# EAGLE schematic memory (EAGLE 6.6.0), part 2 of 2
## Sheet 11 of 15
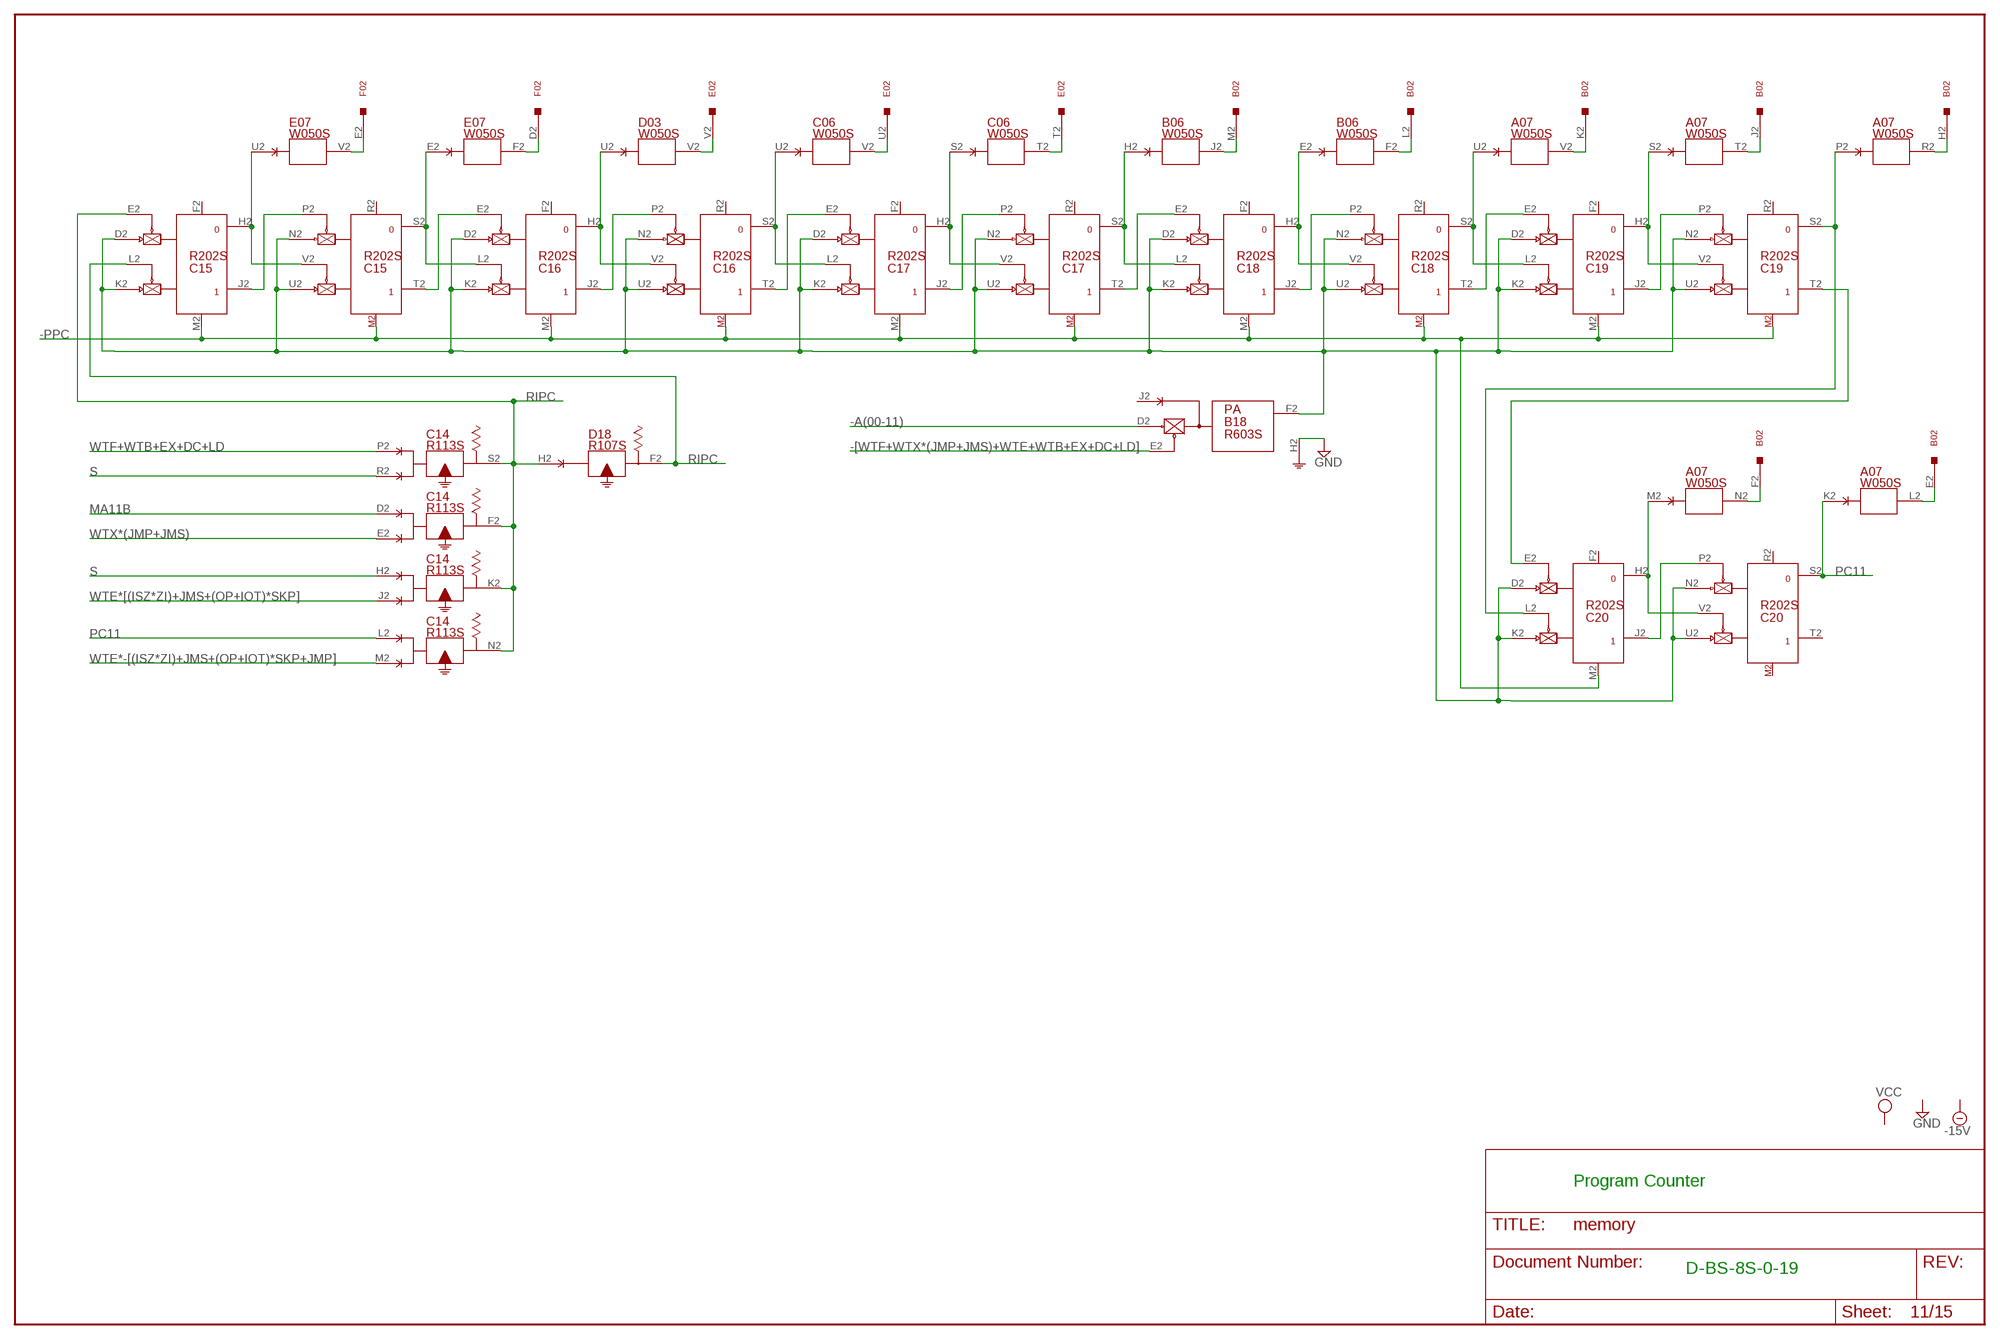
[diagram p10: schematic, sheet 11]

### Parts
C15  R202S  [H807S]
C16  R202S  [H807S]
C17  R202S  [H807S]
C18  R202S  [H807S]
C19  R202S  [H807S]
C20  R202S  [H807S]
D03  W050S  [H807S]

### Nets
-[WTF+WTX*(JMP+JMS)+WTE+WTB+EX+DC+LD]: B18.E2(F:EN0) ; also sheet 6
-A(00-11): B18.D2(F:PU0) ; also sheet 1,3,4,5,7,9,12
-PPC: C15.M2(J:SET) C16.M2(J:SET) C17.M2(J:SET) C18.M2(J:SET) C19.M2(J:SET) C20.M2(J:SET) ; also sheet 4,6,8,10,15
-RIPC: C14.F2(F:O$1) C14.K2(K:O$1) C14.N2(N:O$1) C14.S2(S:O$1) C15.E2(J:EN0) D18.H2(F:I$1)
GND [Supply]: B18.H2(F:G) ; also sheet 1,2,3,4,5,6,7,8,9,10,12,14,15
MA11B: C14.D2(F:I$1) ; also sheet 5
N$245: C15.H2 C15.V2(T:EN1) E07.U2(V:I$1)
N$246: C15.J2 C15.P2(T:EN0)
N$247: B18.F2(F:O) C15.D2(J:PU0) C15.K2(J:PU1) C15.N2(T:PU0) C15.U2(T:PU1) C16.D2(J:PU0) C16.K2(J:PU1) C16.N2(T:PU0) C16.U2(T:PU1) C17.D2(J:PU0) C17.K2(J:PU1) C17.N2(T:PU0) C17.U2(T:PU1) C18.D2(J:PU0) C18.K2(J:PU1) C18.N2(T:PU0) C18.U2(T:PU1) C19.D2(J:PU0) C19.K2(J:PU1) C19.N2(T:PU0) C19.U2(T:PU1) C20.D2(J:PU0) C20.K2(J:PU1) C20.N2(T:PU0) C20.U2(T:PU1)
N$248: C16.H2 C16.V2(T:EN1) D03.U2(V:I$1)
N$249: C16.J2 C16.P2(T:EN0)
N$250: A07.L2(L:O$1) B02.E2
N$251: C06.S2(T:I$1) C17.H2 C17.V2(T:EN1)
N$252: C17.J2 C17.P2(T:EN0)
N$253: A07.N2(N:O$1) B02.F2
N$254: B06.E2(F:I$1) C18.H2 C18.V2(T:EN1)
N$255: C18.J2 C18.P2(T:EN0)
N$256: A07.V2(V:O$1) B02.K2
N$257: A07.S2(T:I$1) C19.H2 C19.V2(T:EN1)
N$258: C19.J2 C19.P2(T:EN0)
N$259: A07.T2(T:O$1) B02.J2
N$260: A07.M2(N:I$1) C20.H2 C20.V2(T:EN1)
N$261: C20.J2 C20.P2(T:EN0)
N$262: A07.R2(R:O$1) B02.H2
N$263: C15.S2 C16.L2(J:EN1) E07.E2(F:I$1)
N$264: C15.T2 C16.E2(J:EN0)
N$265: C06.U2(V:I$1) C16.S2 C17.L2(J:EN1)
N$266: C16.T2 C17.E2(J:EN0)
N$267: B06.H2(J:I$1) C17.S2 C18.L2(J:EN1)
N$268: A07.U2(V:I$1) C18.S2 C19.L2(J:EN1)
N$269: C18.T2 C19.E2(J:EN0)
N$270: C17.T2 C18.E2(J:EN0)
N$271: A07.P2(R:I$1) C19.S2 C20.L2(J:EN1)
N$272: C19.T2 C20.E2(J:EN0)
N$273: B02.M2 B06.J2(J:O$1)
N$274: B02.L2 B06.F2(F:O$1)
N$275: D03.V2(V:O$1) E02.V2
N$276: C06.V2(V:O$1) E02.U2
N$277: C06.T2(T:O$1) E02.T2
N$278: E07.V2(V:O$1) F02.E2
N$279: E07.F2(F:O$1) F02.D2
PC11: A07.K2(L:I$1) C14.L2(N:I$1) C20.S2 ; also sheet 1,5,7
RIPC: C15.L2(J:EN1) D18.F2(F:O$1)
S: C14.H2(K:I$1) C14.R2(S:I$2) ; also sheet 1,5,7,12
WTE*-[(ISZ*ZI)+JMS+(OP+IOT)*SKP+JMP]: C14.M2(N:I$2) ; also sheet 5,6
WTE*[(ISZ*ZI)+JMS+(OP+IOT)*SKP]: C14.J2(K:I$2) ; also sheet 5,6
WTF+WTB+EX+DC+LD: C14.P2(S:I$1) ; also sheet 6
WTX*(JMP+JMS): C14.E2(F:I$2) ; also sheet 5,6,15
Unconnected: B18.J2(F:I$1) C15.F2(J:RESET) C15.R2(T:RESET) C16.F2(J:RESET) C16.R2(T:RESET) C17.F2(J:RESET) C17.R2(T:RESET) C18.F2(J:RESET) C18.R2(T:RESET) C19.F2(J:RESET) C19.R2(T:RESET) C20.F2(J:RESET) C20.R2(T:RESET) C20.T2

### Notes on the sheet
- Program Counter
- D-BS-8S-0-19

## Sheet 12 of 15
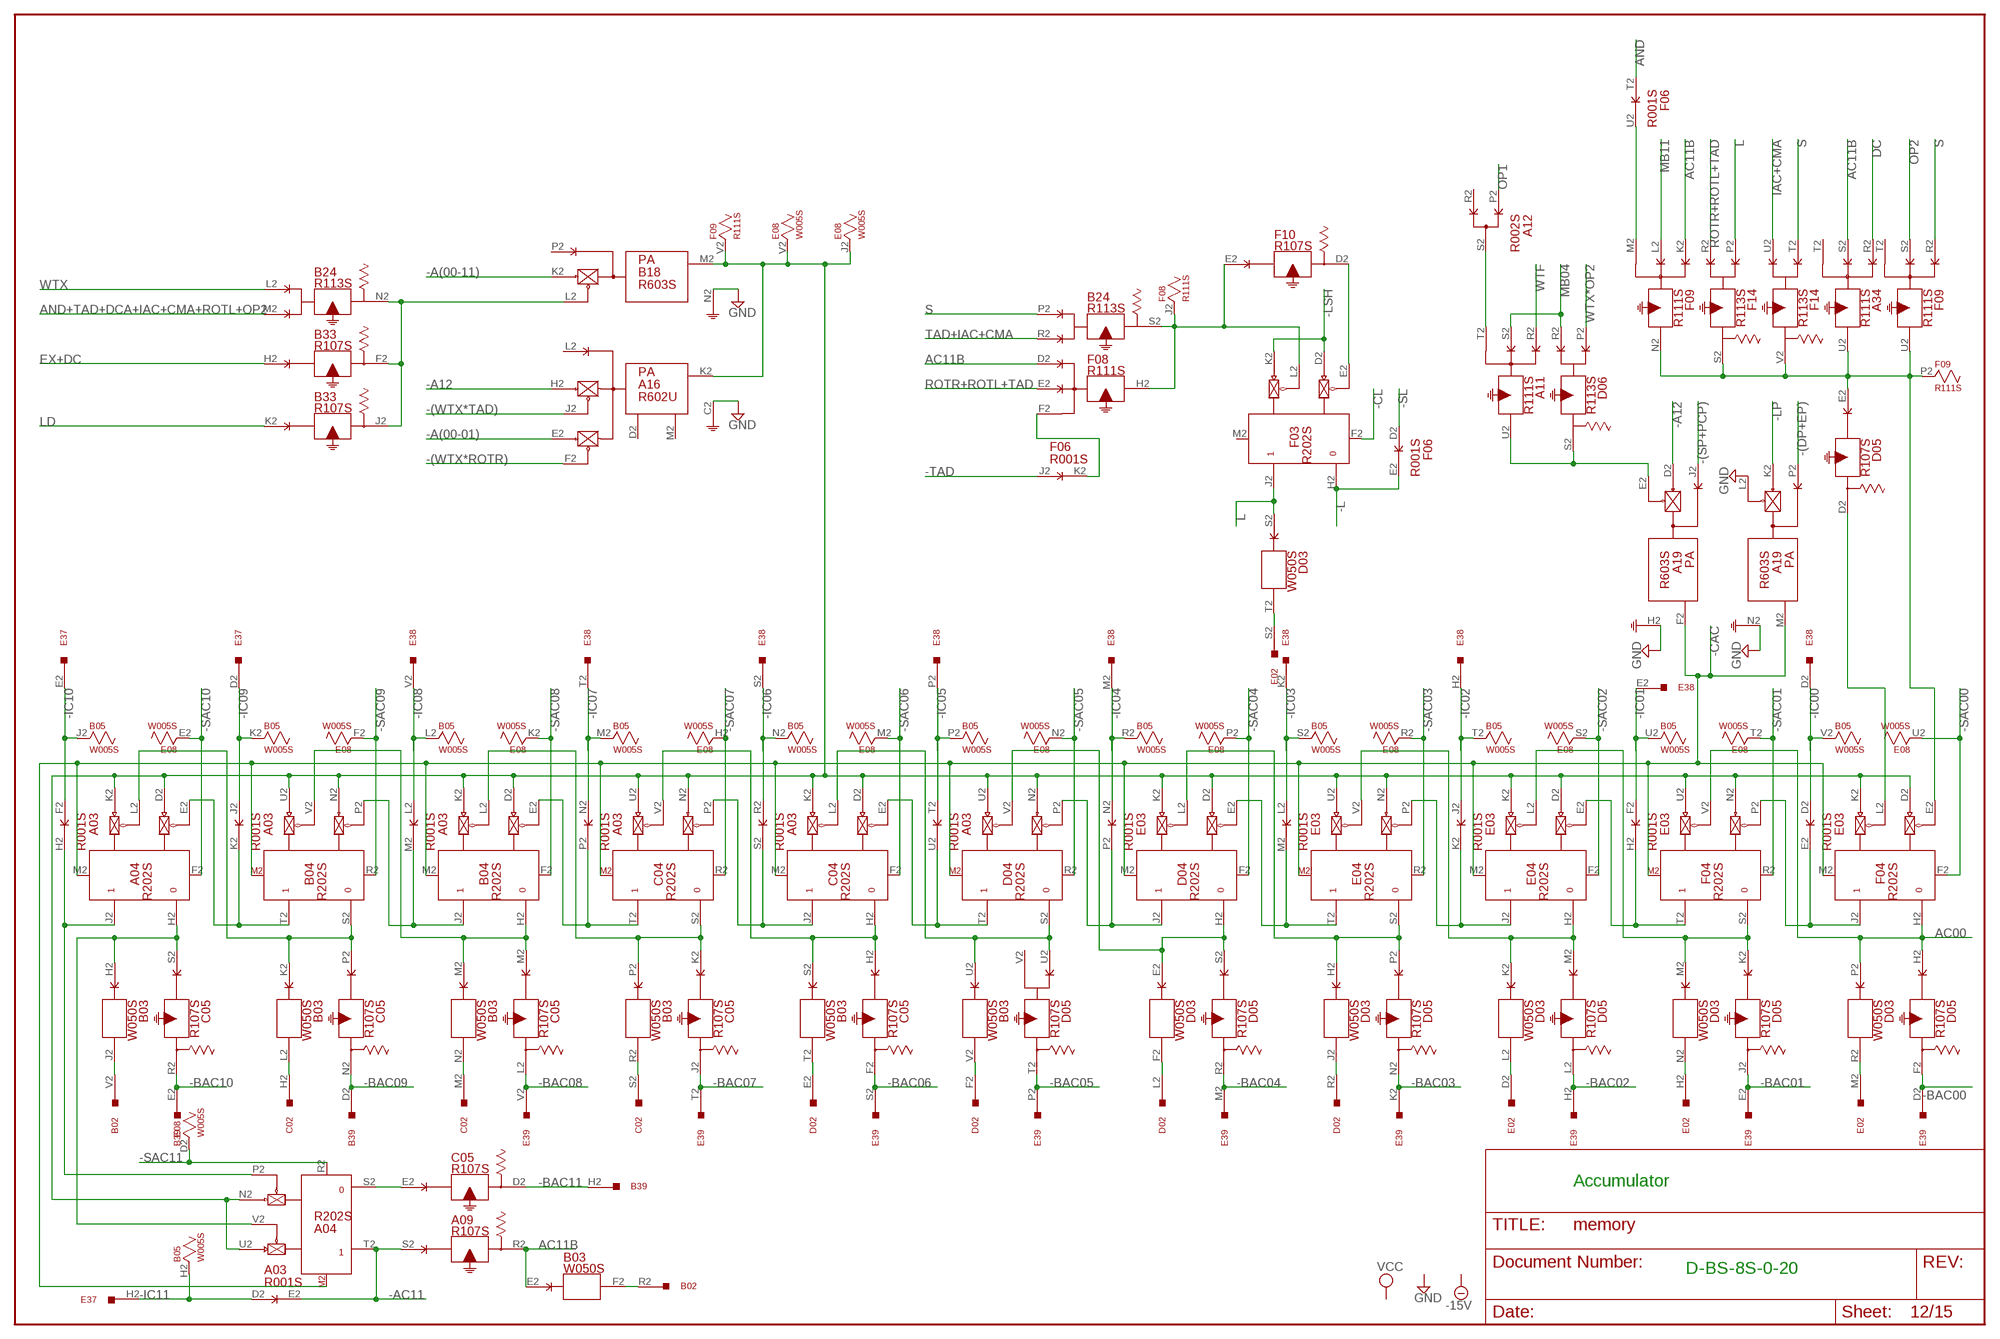
[diagram p11: schematic, sheet 12]

### Parts
A03  R001S  [H807S]
A04  R202S  [H807S]
A19  R603S  [H807S]
B03  W050S  [H807S]
B04  R202S  [H807S]
C04  R202S  [H807S]
D04  R202S  [H807S]
D05  R107S  [H807S]
E04  R202S  [H807S]
E08  W005S  [H807S]
E38  W028S  [H807S]
E39  W028S  [H807S]
F04  R202S  [H807S]

### Nets
-(DP+EP): A19.P2(M:I$1) ; also sheet 4,6,8
-(SP+PCP): A19.J2(F:I$1) ; also sheet 1,3,7,8,10,14,15
-(WTX*ROTR): A16.F2(K:F) ; also sheet 3,6
-(WTX*TAD): A16.J2(K:J) ; also sheet 6
-A12: A16.H2(K:H) A19.D2(F:PU0) ; also sheet 1,3,4,6,8,10,15
-A(00-01): A16.E2(K:E) ; also sheet 3,4
-A(00-11): B18.K2(M:PU0) ; also sheet 1,3,4,5,7,9,11
-AC11: A03.E2(E:E) A04.T2 A09.S2(R:I$1) ; also sheet 7
-BAC00: D05.F2(F:O$1) E39.D2
-BAC01: D05.J2(J:O$1) E39.E2
-BAC02: D05.L2(L:O$1) E39.H2
-BAC03: D05.N2(N:O$1) E39.K2
-BAC04: D05.R2(R:O$1) E39.M2
-BAC05: D05.T2(T:O$1) E39.P2
-BAC06: C05.F2(F:O$1) E39.S2
-BAC07: C05.J2(J:O$1) E39.T2
-BAC08: C05.L2(L:O$1) E39.V2
-BAC09: B39.D2 C05.N2(N:O$1)
-BAC10: B39.E2 C05.R2(R:O$1)
-BAC11: B39.H2 C05.D2(D:O$1)
-CAC: A04.M2(J:SET) A19.F2(F:O) A19.M2(M:O) B04.M2(J:SET) C04.M2(J:SET) D04.M2(J:SET) E04.M2(J:SET) F04.M2(J:SET) ; also sheet 10
-CL: F03.F2(J:RESET) ; also sheet 3
-IC00: B05.V2 E03.D2(E:D) E38.D2
-IC01: B05.U2 E03.F2(H:D) E38.E2
-IC02: B05.T2 E03.J2(K:D) E38.H2
-IC03: B05.S2 E03.L2(M:D) E38.K2
-IC04: B05.R2 E03.N2(P:D) E38.M2
-IC05: A03.T2(U:D) B05.P2 E38.P2
-IC06: A03.R2(S:D) B05.N2 E38.S2
-IC07: A03.N2(P:D) B05.M2 E38.T2
-IC08: A03.L2(M:D) B05.L2 E38.V2
-IC09: A03.J2(K:D) B05.K2 E37.D2
-IC10: A03.F2(H:D) B05.J2 E37.E2
-IC11: A03.D2(E:D) B05.H2 E37.H2
-L: F03.H2 F06.E2(E:E) ; also sheet 3
-LP: A19.K2(M:PU0) ; also sheet 4,6,8,15
-LSH: F03.D2(J:PU0) F03.K2(J:PU1) ; also sheet 3
-SAC00: E08.U2 F04.F2(J:RESET) ; also sheet 8
-SAC01: E08.T2 F04.R2(T:RESET) ; also sheet 8
-SAC02: E04.F2(J:RESET) E08.S2 ; also sheet 8
-SAC03: E04.R2(T:RESET) E08.R2 ; also sheet 8
-SAC04: D04.F2(J:RESET) E08.P2 ; also sheet 8
-SAC05: D04.R2(T:RESET) E08.N2 ; also sheet 8
-SAC06: C04.F2(J:RESET) E08.M2 ; also sheet 8
-SAC07: C04.R2(T:RESET) E08.H2 ; also sheet 8
-SAC08: B04.F2(J:RESET) E08.K2 ; also sheet 8
-SAC09: B04.R2(T:RESET) E08.F2 ; also sheet 8
-SAC10: A04.F2(J:RESET) E08.E2 ; also sheet 8
-SAC11: A04.R2(T:RESET) E08.D2 ; also sheet 8
-SL: F06.D2(E:D) ; also sheet 3
-TAD: F06.J2(K:D) ; also sheet 9
AC00: D03.P2(R:I$1) D05.H2(F:I$1) F04.H2 F04.V2(T:EN1) ; also sheet 3
AC11B: A09.R2(R:O$1) A34.S2(U:I$2) B03.E2(F:I$1) F08.D2(H:I$1) F09.K2(N:I$1) ; also sheet 1,7
AND: F06.T2(U:D) ; also sheet 9
AND+TAD+DCA+IAC+CMA+ROTL+OP2: B24.M2(N:I$2) ; also sheet 9
DC: A34.R2(U:I$1) ; also sheet 1,8
EX+DC: B33.H2(F:I$1) ; also sheet 5,7,8,9
GND [Supply]: A16.C2(K:GND) A19.H2(F:G) A19.L2(M:EN0) A19.N2(M:G) B18.N2(M:G) ; also sheet 1,2,3,4,5,6,7,8,9,10,11,14,15
IAC+CMA: F14.U2(V:I$2) ; also sheet 7,9
L: D03.S2(T:I$1) F03.J2 F14.P2(S:I$1) ; also sheet 3,7
LD: B33.K2(J:I$1) ; also sheet 7,8
MB04: A11.S2(U:I$2) D06.R2(S:I$2) ; also sheet 1
MB11: F09.L2(N:I$2) ; also sheet 1,5,6,7,9
N$281: D03.M2(N:I$1) D05.K2(J:I$1) E04.L2(J:EN1) F04.S2
N$282: B03.U2(V:I$1) C04.L2(J:EN1) D04.S2 D05.U2(T:I$1)
N$283: B02.R2 B03.F2(F:O$1)
N$284: D03.K2(L:I$1) D05.M2(L:I$1) E04.H2 E04.V2(T:EN1)
N$285: D03.E2(F:I$1) D04.H2 D04.V2(T:EN1) D05.S2(R:I$1)
N$286: D03.H2(J:I$1) D04.L2(J:EN1) D05.P2(N:I$1) E04.S2
N$287: B03.S2(T:I$1) C04.H2 C04.V2(T:EN1) C05.H2(F:I$1)
N$288: B03.P2(R:I$1) B04.L2(J:EN1) C04.S2 C05.K2(J:I$1)
N$289: A04.L2(J:EN1) B03.K2(L:I$1) B04.S2 C05.P2(N:I$1)
N$290: A04.H2 A04.V2(T:EN1) B03.H2(J:I$1) C05.S2(R:I$1)
N$291: B02.V2 B03.J2(J:O$1)
N$293: A04.S2 C05.E2(D:I$1)
N$294: B03.L2(L:O$1) C02.H2
N$295: B03.N2(N:O$1) C02.M2
N$296: B03.R2(R:O$1) C02.S2
N$297: B03.T2(T:O$1) D02.E2
N$298: B03.V2(V:O$1) D02.F2
N$299: D02.L2 D03.F2(F:O$1)
N$300: D02.R2 D03.J2(J:O$1)
N$301: D03.L2(L:O$1) E02.D2
N$302: D03.N2(N:O$1) E02.H2
N$303: D03.R2(R:O$1) E02.M2
N$304: E03.E2(E:E) F04.J2 F04.P2(T:EN0)
N$305: E03.H2(H:E) E04.E2(J:EN0) F04.T2
N$306: E03.K2(K:E) E04.J2 E04.P2(T:EN0)
N$307: D04.E2(J:EN0) E03.M2(M:E) E04.T2
N$308: A03.U2(U:E) C04.E2(J:EN0) D04.T2
N$309: D04.J2 D04.P2(T:EN0) E03.P2(P:E)
N$310: A03.S2(S:E) C04.J2 C04.P2(T:EN0)
N$311: A03.P2(P:E) B04.E2(J:EN0) C04.T2
N$312: A03.M2(M:E) B04.J2 B04.P2(T:EN0)
N$313: A03.K2(K:E) A04.E2(J:EN0) B04.T2
N$314: A03.H2(H:E) A04.J2 A04.P2(T:EN0)
N$315: A04.D2(J:PU0) A04.K2(J:PU1) A04.N2(T:PU0) A04.U2(T:PU1) A16.K2(K:K) B04.D2(J:PU0) B04.K2(J:PU1) B04.N2(T:PU0) B04.U2(T:PU1) B18.M2(M:O) C04.D2(J:PU0) C04.K2(J:PU1) C04.N2(T:PU0) C04.U2(T:PU1) D04.D2(J:PU0) D04.K2(J:PU1) D04.N2(T:PU0) D04.U2(T:PU1) E04.D2(J:PU0) E04.K2(J:PU1) E04.N2(T:PU0) E04.U2(T:PU1) E08.J2 E08.V2 F04.D2(J:PU0) F04.K2(J:PU1) F04.N2(T:PU0) F04.U2(T:PU1) F09.V2
N$317: B03.M2(N:I$1) B04.H2 B04.V2(T:EN1) C05.M2(L:I$1)
N$318: A34.U2(U:O$1) D05.E2(D:I$1) F04.E2(J:EN0) F09.N2(N:O$1) F09.P2 F09.U2(U:O$1) F14.S2(S:O$1) F14.V2(V:O$1)
N$319: D05.D2(D:O$1) F04.L2(J:EN1)
N$320: F06.U2(U:E) F09.M2(N:I$3)
N$321: A11.T2(U:I$3) A12.S2(S:F)
N$322: A11.U2(U:O$1) A19.E2(F:EN0) D06.S2(S:O$1)
N$323: D03.T2(T:O$1) E02.S2
N$326: F03.E2(J:EN0) F10.D2(D:O$1)
N$327: B24.S2(S:O$1) F03.L2(J:EN1) F08.H2(H:O$1) F08.J2 F10.E2(D:I$1)
N$328: F06.K2(K:E) F08.F2(H:I$3)
N$330: B18.L2(M:EN0) B24.N2(N:O$1) B33.F2(F:O$1) B33.J2(J:O$1)
OP1: A12.P2(S:D) ; also sheet 6,7,9
OP2: F09.S2(U:I$2) ; also sheet 3,6,7,8,9
ROTR+ROTL+TAD: F08.E2(H:I$2) F14.R2(S:I$2) ; also sheet 3,9
S: B24.P2(S:I$1) F09.R2(U:I$1) F14.T2(V:I$1) ; also sheet 1,5,7,11
TAD+IAC+CMA: B24.R2(S:I$2) ; also sheet 3,9
WTF: A11.R2(U:I$1) ; also sheet 1,3,5,6,8,10
WTX: B24.L2(N:I$1) ; also sheet 1,3,6,7,10,15
WTX*OP2: D06.P2(S:I$1) ; also sheet 6
Unconnected: A12.R2(S:E) A16.D2(K:D) A16.L2(K:L) A16.M2(K:M) A34.T2(U:I$3) B18.P2(M:I$1) D05.V2(T:I$2) E08.L2 F03.M2(J:SET) F09.T2(U:I$3)

### Notes on the sheet
- Accumulator
- D-BS-8S-0-20

## Sheet 13 of 15
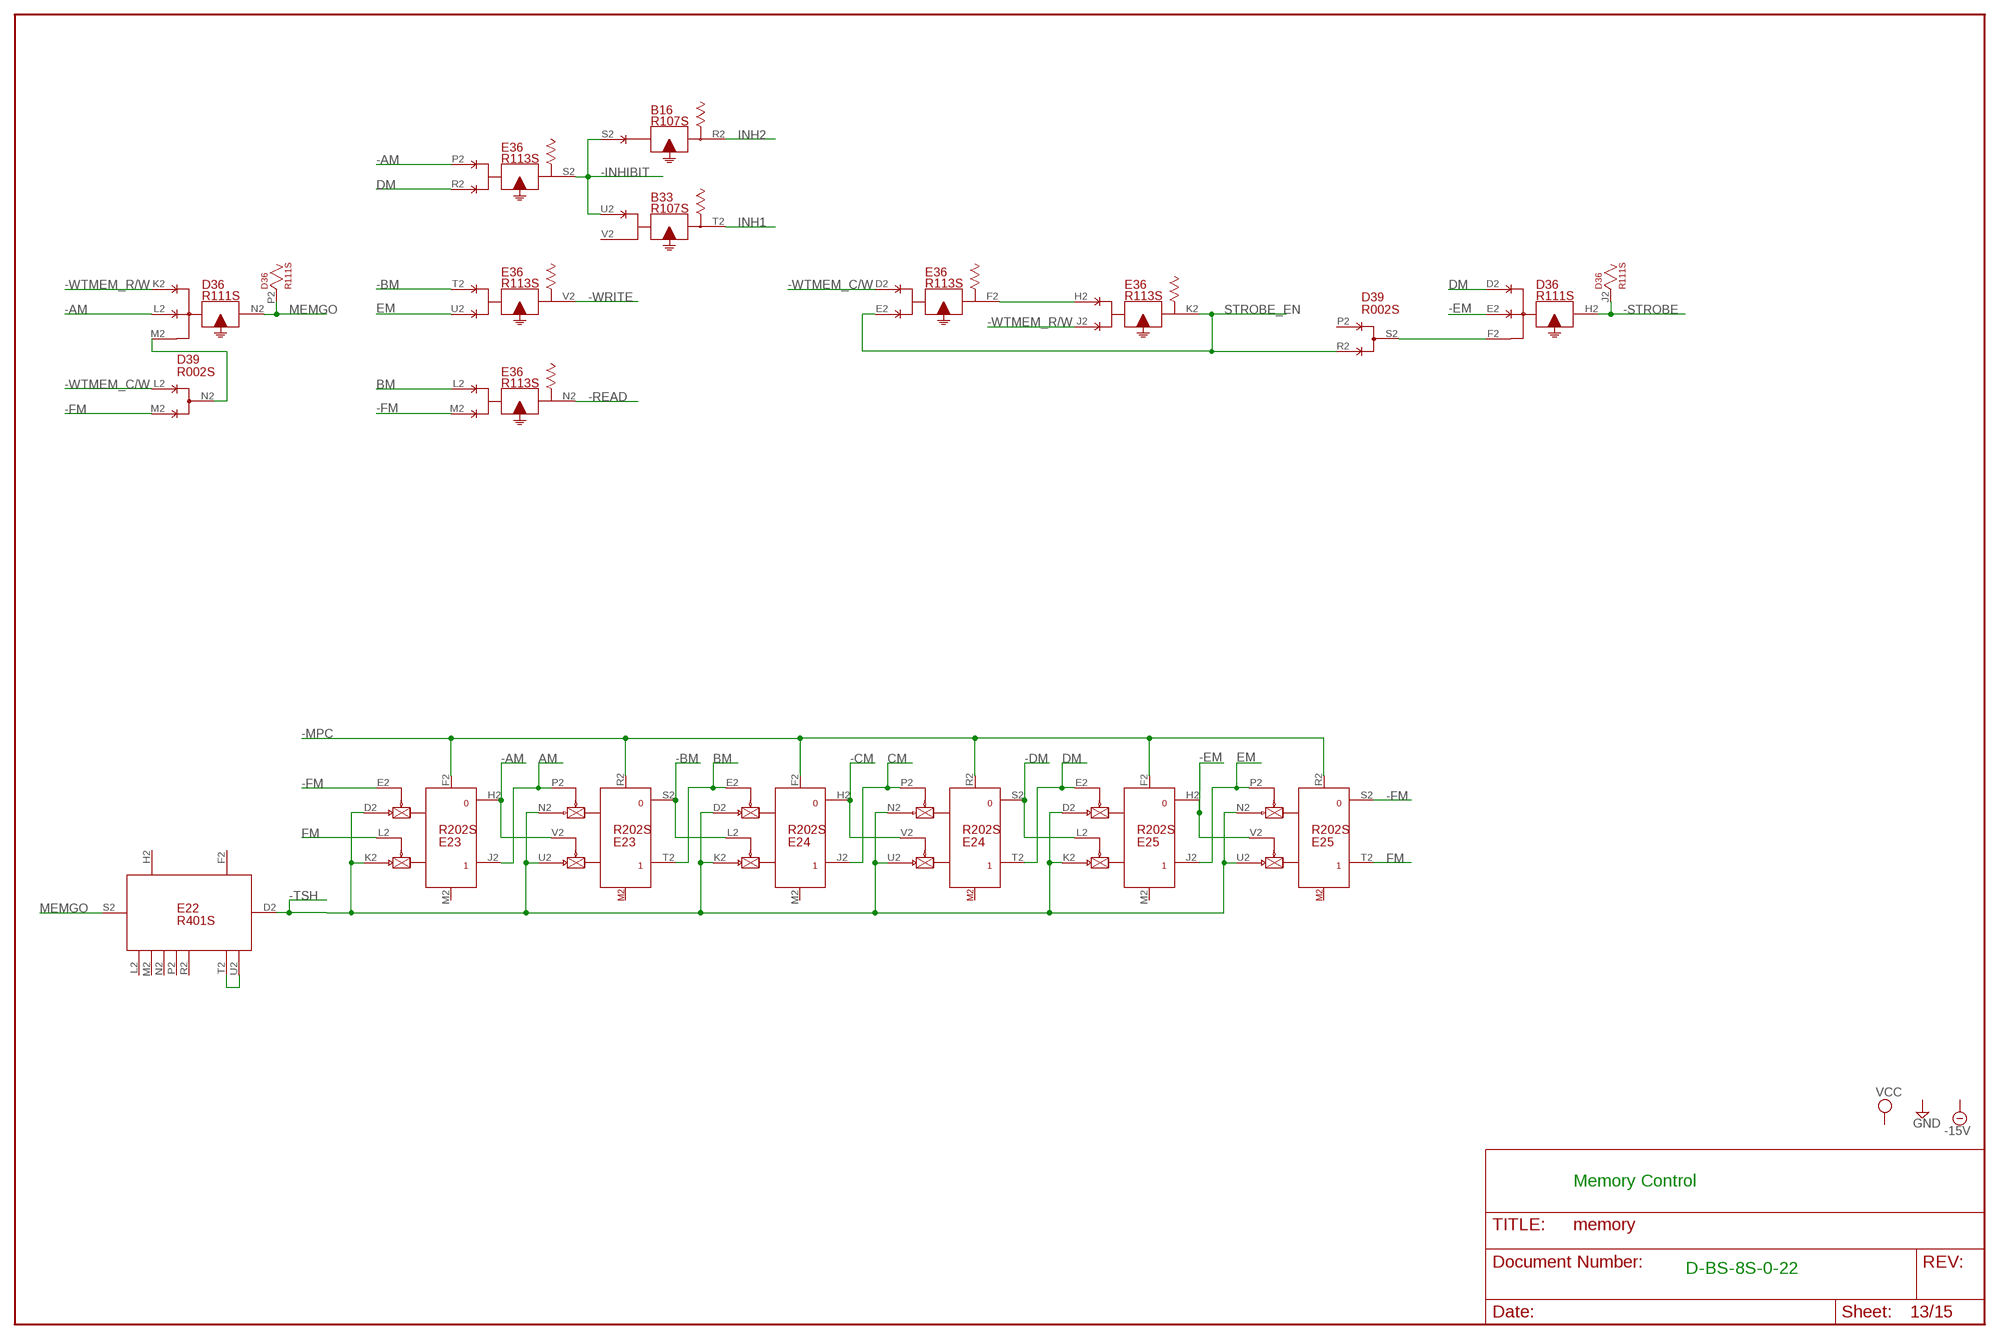
[diagram p12: schematic, sheet 13]

### Parts
E22  R401S  [H807S]
E23  R202S  [H807S]
E24  R202S  [H807S]
E25  R202S  [H807S]
E36  R113S  [H807S]

### Nets
-AM: D36.L2(N:I$2) E23.H2 E23.V2(T:EN1) E36.P2(S:I$1)
-BM: E23.S2 E24.L2(J:EN1) E36.T2(V:I$1)
-CM: E24.H2 E24.V2(T:EN1)
-DM: E24.S2 E25.L2(J:EN1)
-EM: D36.E2(H:I$2) E25.H2 E25.V2(T:EN1)
-FM: D39.M2(N:E) E23.E2(J:EN0) E25.S2 E36.M2(N:I$2)
-INHIBIT: B16.S2(R:I$1) B33.U2(T:I$1) E36.S2(S:O$1)
-MPC: E23.F2(J:RESET) E23.R2(T:RESET) E24.F2(J:RESET) E24.R2(T:RESET) E25.F2(J:RESET) E25.R2(T:RESET) ; also sheet 10,14
-READ: E36.N2(N:O$1) ; also sheet 2
-STROBE: D36.H2(H:O$1) D36.J2 ; also sheet 2
-TSH: E22.D2(D) E23.D2(J:PU0) E23.K2(J:PU1) E23.N2(T:PU0) E23.U2(T:PU1) E24.D2(J:PU0) E24.K2(J:PU1) E24.N2(T:PU0) E24.U2(T:PU1) E25.D2(J:PU0) E25.K2(J:PU1) E25.N2(T:PU0) E25.U2(T:PU1)
-WRITE: E36.V2(V:O$1)
-WTMEM_C/W: D39.L2(N:D) E36.D2(F:I$1) ; also sheet 6
-WTMEM_R/W: D36.K2(N:I$1) E36.J2(K:I$2) ; also sheet 1,6
AM: E23.J2 E23.P2(T:EN0)
BM: E23.T2 E24.E2(J:EN0) E36.L2(N:I$1)
CM: E24.J2 E24.P2(T:EN0)
DM: D36.D2(H:I$1) E24.T2 E25.E2(J:EN0) E36.R2(S:I$2)
EM: E25.J2 E25.P2(T:EN0) E36.U2(V:I$2)
FM: E23.L2(J:EN1) E25.T2
INH1: B33.T2(T:O$1) ; also sheet 2
INH2: B16.R2(R:O$1)
MEMGO: D36.N2(N:O$1) D36.P2 E22.S2(S) ; also sheet 6
N$329: E22.T2(T) E22.U2(U)
N$331: D36.F2(H:I$3) D39.S2(S:F)
N$332: D36.M2(N:I$3) D39.N2(N:F)
N$334: E36.F2(F:O$1) E36.H2(K:I$1)
STROBE_EN: D39.R2(S:E) E36.E2(F:I$2) E36.K2(K:O$1)
Unconnected: B33.V2(T:I$2) D39.P2(S:D) E22.F2(F) E22.H2(H) E22.L2(L) E22.M2(M) E22.N2(N) E22.P2(P) E22.R2(R) E23.M2(J:SET) E24.M2(J:SET) E25.M2(J:SET)

### Notes on the sheet
- Memory Control
- D-BS-8S-0-22

## Sheet 14 of 15
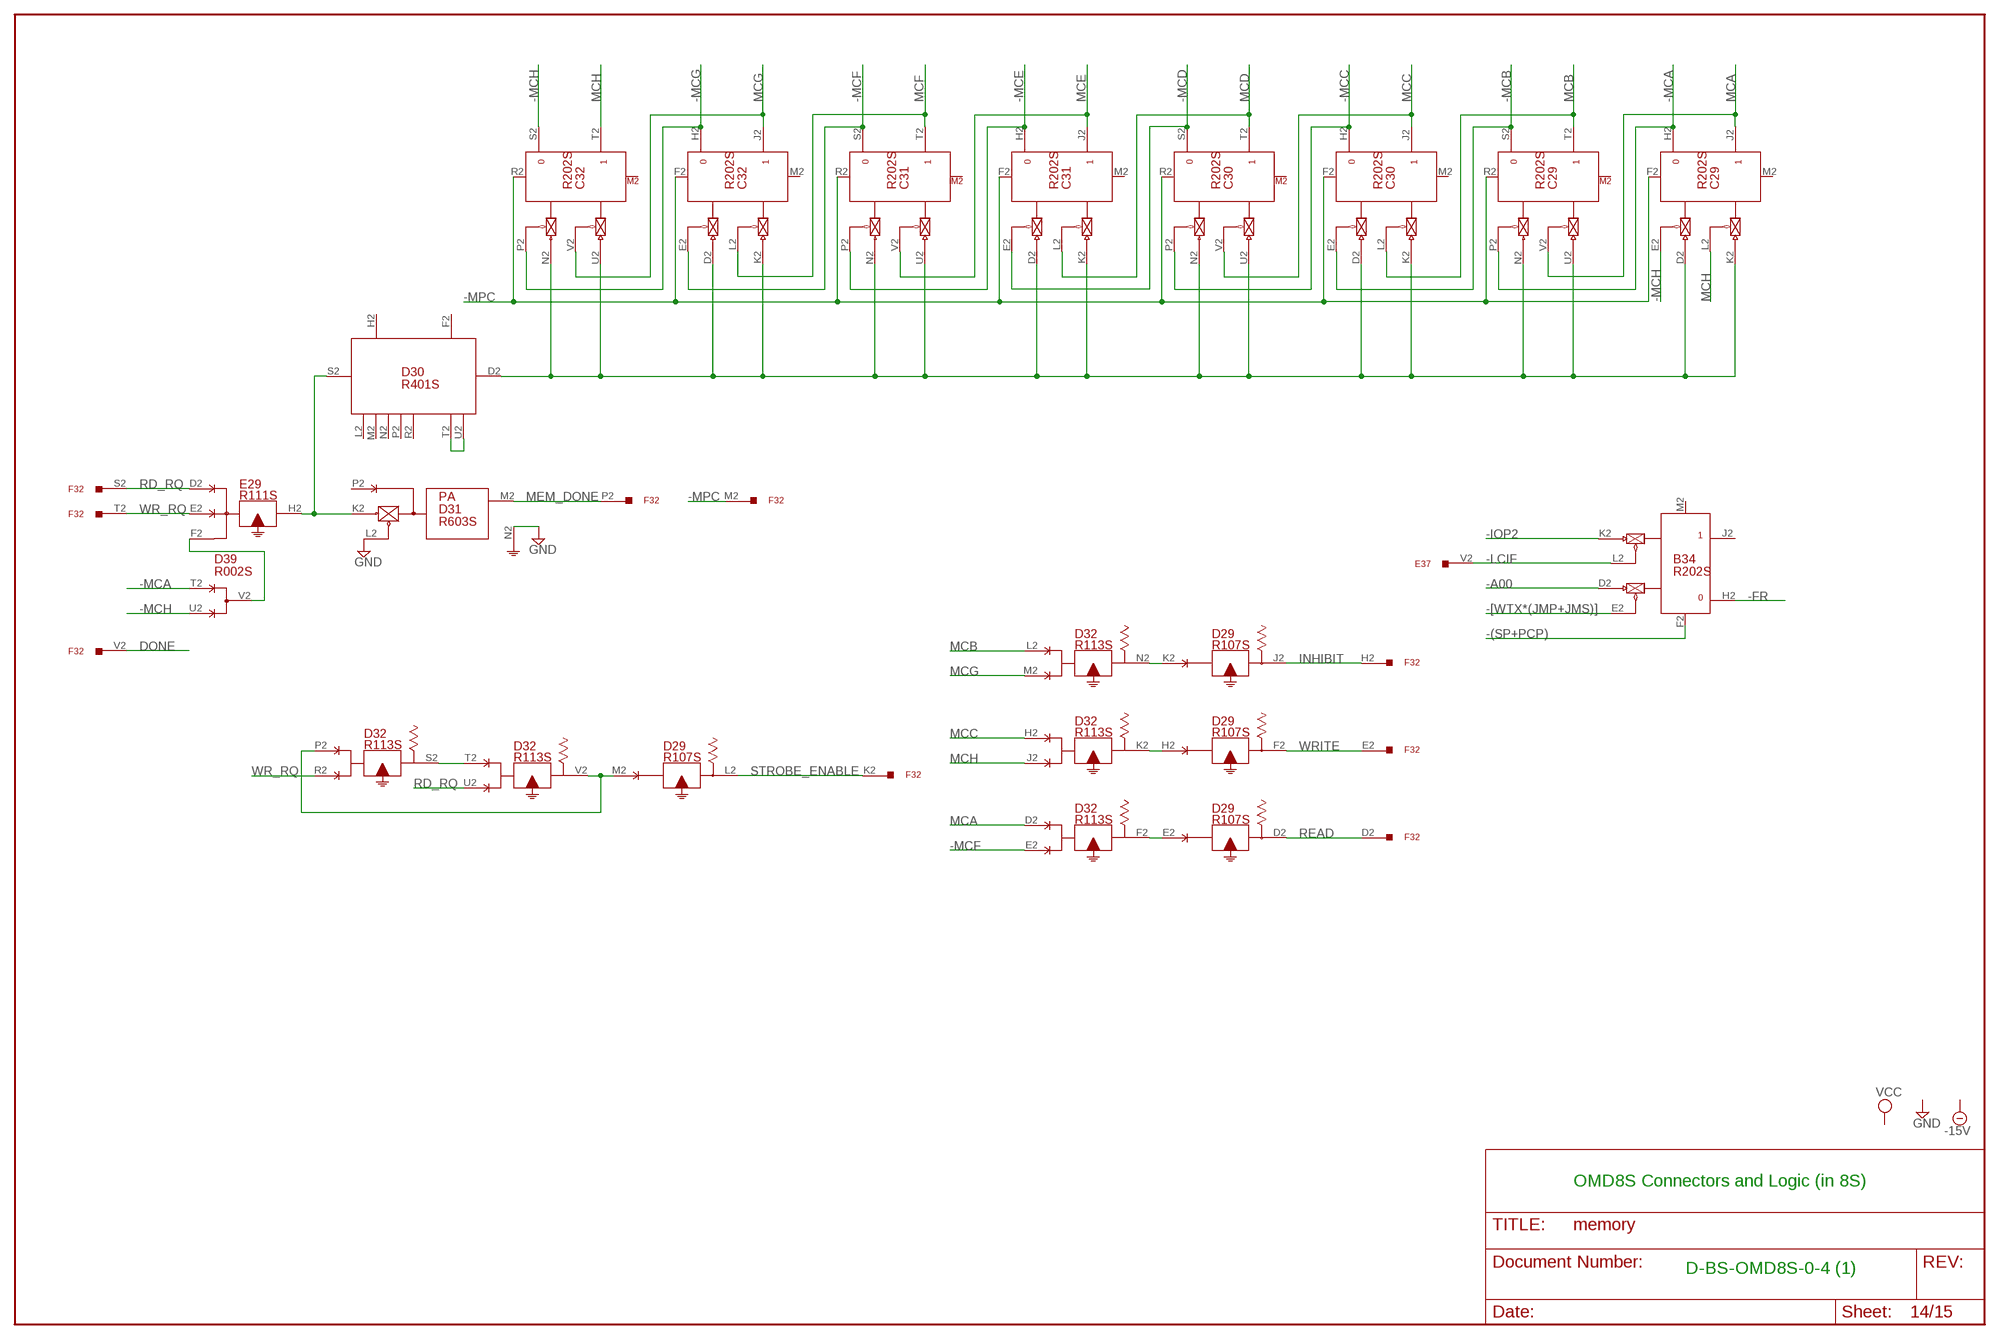
[diagram p13: schematic, sheet 14]

### Parts
C29  R202S  [H807S]
C30  R202S  [H807S]
C31  R202S  [H807S]
C32  R202S  [H807S]
D29  R107S  [H807S]
D30  R401S  [H807S]
D31  R603S  [H807S]
D32  R113S  [H807S]
E29  R111S  [H807S]
F32  W021S  [H807S]

### Nets
-(SP+PCP): B34.F2(J:RESET) ; also sheet 1,3,7,8,10,12,15
-[WTX*(JMP+JMS)]: B34.E2(J:EN0) ; also sheet 6
-A00: B34.D2(J:PU0) ; also sheet 3,4,5,9,10,15
-FR: B34.H2 ; also sheet 10
-IOP2: B34.K2(J:PU1) ; also sheet 10
-LCIF: B34.L2(J:EN1) E37.V2
-MCA: C29.H2 C29.P2(T:EN0) D39.T2(V:D)
-MCB: C29.S2 C30.E2(J:EN0)
-MCC: C30.H2 C30.P2(T:EN0)
-MCD: C30.S2 C31.E2(J:EN0)
-MCE: C31.H2 C31.P2(T:EN0)
-MCF: C31.S2 C32.E2(J:EN0) D32.E2(F:I$2)
-MCG: C32.H2 C32.P2(T:EN0)
-MCH: C29.E2(J:EN0) C32.S2 D39.U2(V:E)
-MPC: C29.F2(J:RESET) C29.R2(T:RESET) C30.F2(J:RESET) C30.R2(T:RESET) C31.F2(J:RESET) C31.R2(T:RESET) C32.F2(J:RESET) C32.R2(T:RESET) F32.M2 ; also sheet 10,13
DONE: F32.V2
GND [Supply]: D31.L2(M:EN0) D31.N2(M:G) ; also sheet 1,2,3,4,5,6,7,8,9,10,11,12,15
INHIBIT: D29.J2(J:O$1) F32.H2
MCA: C29.J2 C29.V2(T:EN1) D32.D2(F:I$1)
MCB: C29.T2 C30.L2(J:EN1) D32.L2(N:I$1)
MCC: C30.J2 C30.V2(T:EN1) D32.H2(K:I$1)
MCD: C30.T2 C31.L2(J:EN1)
MCE: C31.J2 C31.V2(T:EN1)
MCF: C31.T2 C32.L2(J:EN1)
MCG: C32.J2 C32.V2(T:EN1) D32.M2(N:I$2)
MCH: C29.L2(J:EN1) C32.T2 D32.J2(K:I$2)
MEM_DONE: D31.M2(M:O) F32.P2
N$43: D39.V2(V:F) E29.F2(H:I$3)
N$45: D30.T2(T) D30.U2(U)
N$70: D30.S2(S) D31.K2(M:PU0) E29.H2(H:O$1)
N$80: C29.D2(J:PU0) C29.K2(J:PU1) C29.N2(T:PU0) C29.U2(T:PU1) C30.D2(J:PU0) C30.K2(J:PU1) C30.N2(T:PU0) C30.U2(T:PU1) C31.D2(J:PU0) C31.K2(J:PU1) C31.N2(T:PU0) C31.U2(T:PU1) C32.D2(J:PU0) C32.K2(J:PU1) C32.N2(T:PU0) C32.U2(T:PU1) D30.D2(D)
N$85: D29.M2(L:I$1) D32.P2(S:I$1) D32.V2(V:O$1)
N$91: D32.S2(S:O$1) D32.T2(V:I$1)
N$93: D29.E2(D:I$1) D32.F2(F:O$1)
N$96: D29.H2(F:I$1) D32.K2(K:O$1)
N$98: D29.K2(J:I$1) D32.N2(N:O$1)
RD_RQ: D32.U2(V:I$2) E29.D2(H:I$1) F32.S2
READ: D29.D2(D:O$1) F32.D2 ; also sheet 15
STROBE_ENABLE: D29.L2(L:O$1) F32.K2
WR_RQ: D32.R2(S:I$2) E29.E2(H:I$2) F32.T2
WRITE: D29.F2(F:O$1) F32.E2 ; also sheet 15
Unconnected: B34.J2 B34.M2(J:SET) C29.M2(J:SET) C30.M2(J:SET) C31.M2(J:SET) C32.M2(J:SET) D30.F2(F) D30.H2(H) D30.L2(L) D30.M2(M) D30.N2(N) D30.P2(P) D30.R2(R) D31.P2(M:I$1) E29.J2 E29.P2

### Notes on the sheet
- OMD8S Connectors and Logic (in 8S)
- D-BS-OMD8S-0-4 (1)

## Sheet 15 of 15
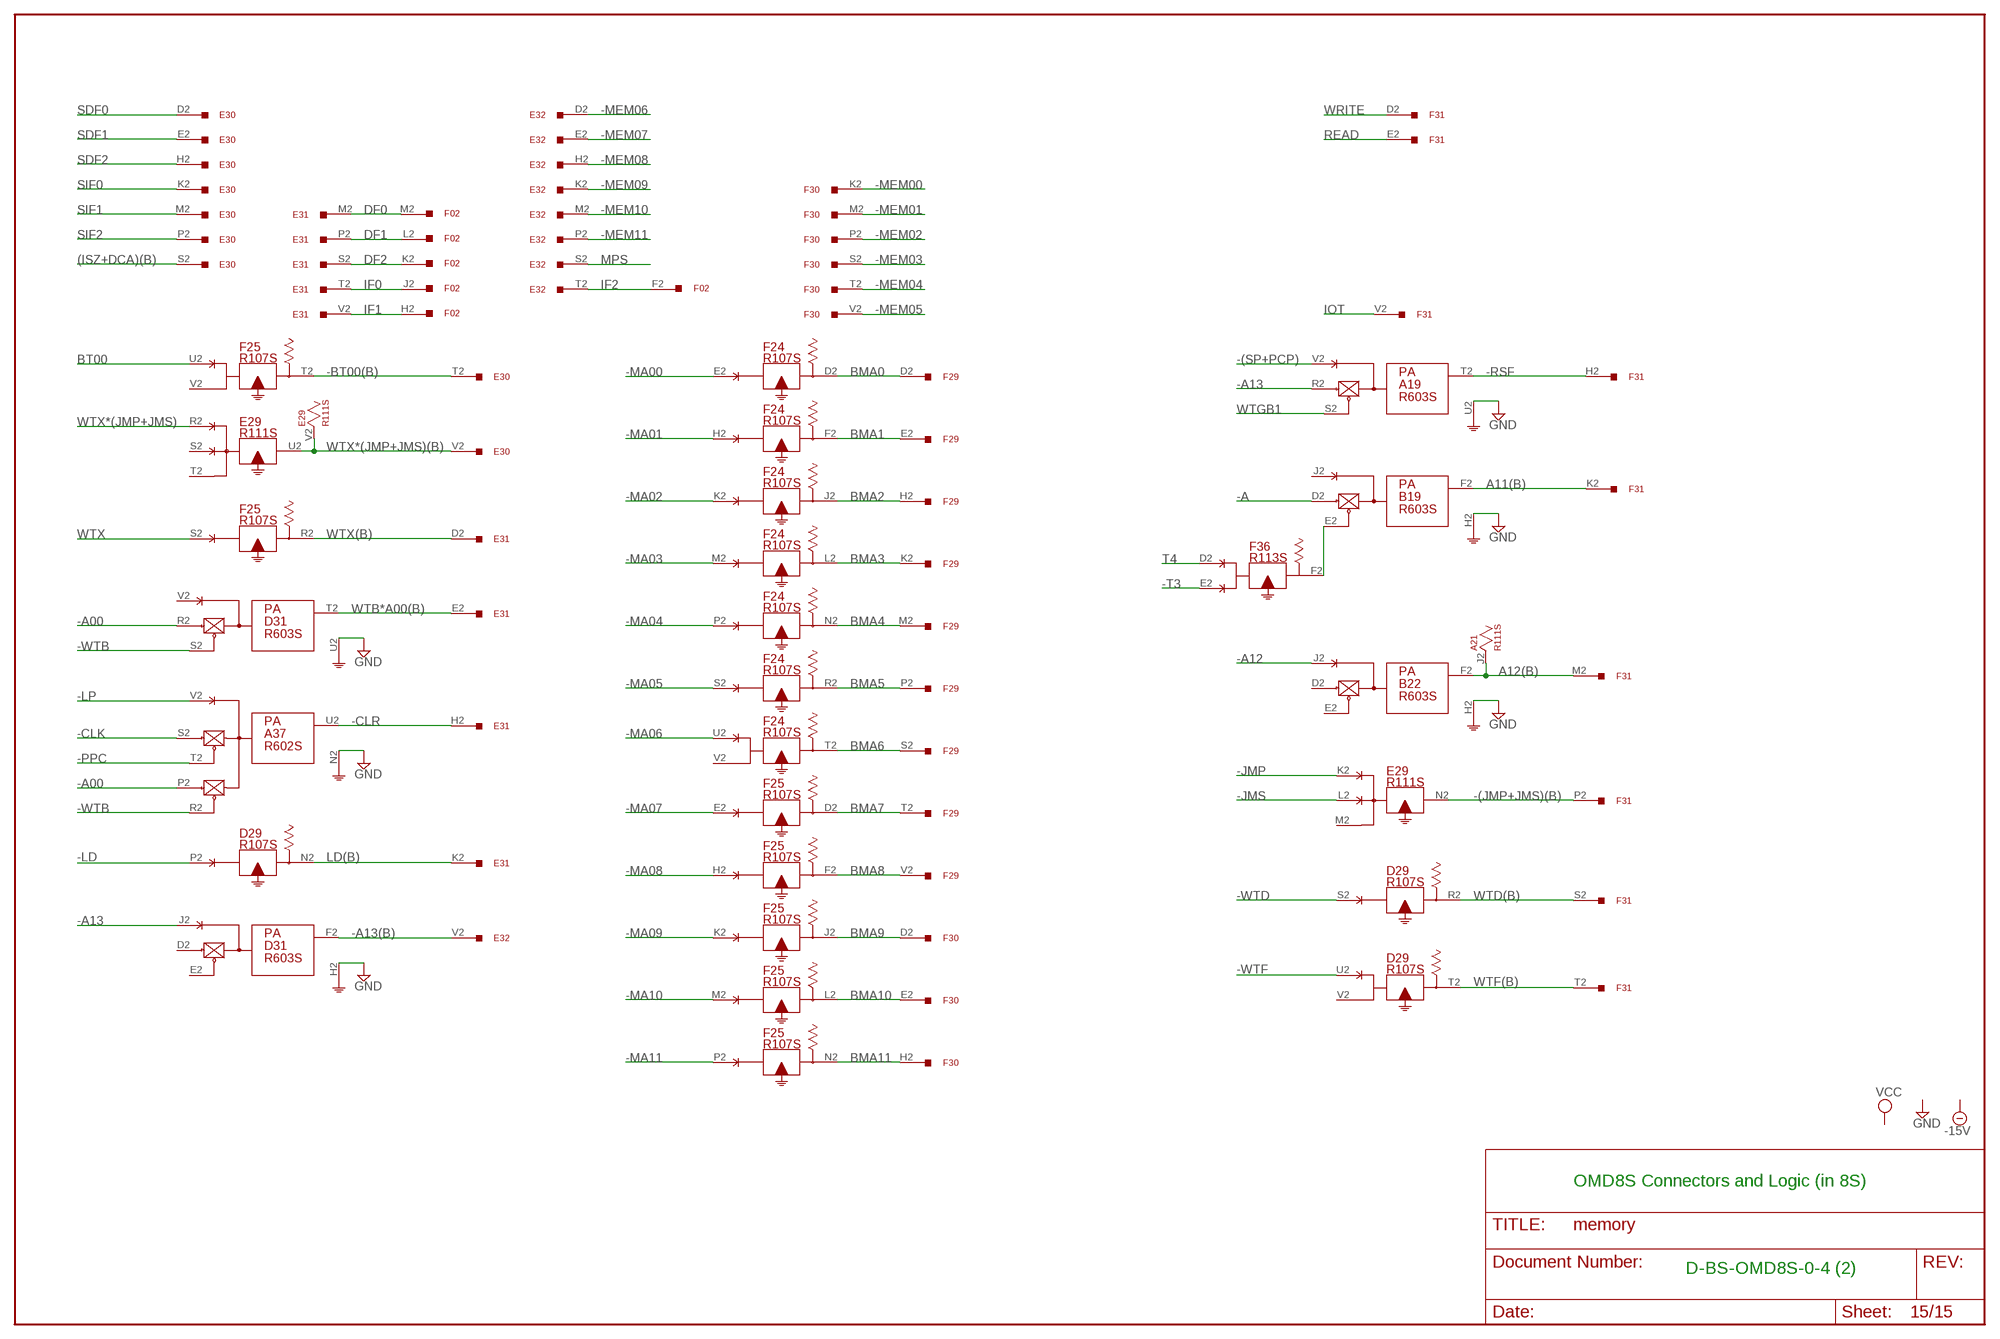
[diagram p14: schematic, sheet 15]

### Parts
E30  W021S  [H807S]
E31  W021S  [H807S]
E32  W021S  [H807S]
F24  R107S  [H807S]
F25  R107S  [H807S]
F29  W021S  [H807S]
F30  W021S  [H807S]
F31  W021S  [H807S]

### Nets
(ISZ+DCA)(B): E30.S2
-(JMP+JMS)(B): E29.N2(N:O$1) F31.P2
-(SP+PCP): A19.V2(T:I$1) ; also sheet 1,3,7,8,10,12,14
-A: B19.D2(F:PU0) ; also sheet 4
-A00: A37.P2(U:E) D31.R2(T:PU0) ; also sheet 3,4,5,9,10,14
-A12: B22.J2(F:I$1) ; also sheet 1,3,4,6,8,10,12
-A13: A19.R2(T:PU0) D31.J2(F:I$1) ; also sheet 1,4,5,6,7,10
-A13(B): D31.F2(F:O) E32.V2
-BT00(B): E30.T2 F25.T2(T:O$1)
-CLK: A37.S2(U:H) ; also sheet 4,8
-CLR: A37.U2(U:K) E31.H2
-JMP: E29.K2(N:I$1) ; also sheet 9
-JMS: E29.L2(N:I$2) ; also sheet 9
-LD: D29.P2(N:I$1) ; also sheet 6,8
-LP: A37.V2(U:L) ; also sheet 4,6,8,12
-MA00: F24.E2(D:I$1) ; also sheet 2,5
-MA01: F24.H2(F:I$1) ; also sheet 2,5
-MA02: F24.K2(J:I$1) ; also sheet 2,5
-MA03: F24.M2(L:I$1) ; also sheet 2,5
-MA04: F24.P2(N:I$1) ; also sheet 2,5,6
-MA05: F24.S2(R:I$1) ; also sheet 2,5
-MA06: F24.U2(T:I$1) ; also sheet 2,5
-MA07: F25.E2(D:I$1) ; also sheet 2,5
-MA08: F25.H2(F:I$1) ; also sheet 2,5
-MA09: F25.K2(J:I$1) ; also sheet 2,5
-MA10: F25.M2(L:I$1) ; also sheet 2,5
-MA11: F25.P2(N:I$1) ; also sheet 2,5
-MEM00: F30.K2 ; also sheet 1,2
-MEM01: F30.M2 ; also sheet 1,2
-MEM02: F30.P2 ; also sheet 1,2
-MEM03: F30.S2 ; also sheet 1,2
-MEM04: F30.T2 ; also sheet 1,2
-MEM05: F30.V2 ; also sheet 1,2
-MEM06: E32.D2 ; also sheet 1,2
-MEM07: E32.E2 ; also sheet 1,2
-MEM08: E32.H2 ; also sheet 1,2
-MEM09: E32.K2 ; also sheet 1,2
-MEM10: E32.M2 ; also sheet 1,2
-MEM11: E32.P2 ; also sheet 1,2
-PPC: A37.T2(U:J) ; also sheet 4,6,8,10,11
-RSF: A19.T2(T:O) F31.H2
-T3: F36.E2(F:I$2) ; also sheet 4
-WTB: A37.R2(U:F) D31.S2(T:EN0) ; also sheet 6,9
-WTD: D29.S2(R:I$1) ; also sheet 6
-WTF: D29.U2(T:I$1) ; also sheet 6,7,9
A11(B): B19.F2(F:O) F31.K2
A12(B): A21.J2 B22.F2(F:O) F31.M2
BMA0: F24.D2(D:O$1) F29.D2
BMA1: F24.F2(F:O$1) F29.E2
BMA2: F24.J2(J:O$1) F29.H2
BMA3: F24.L2(L:O$1) F29.K2
BMA4: F24.N2(N:O$1) F29.M2
BMA5: F24.R2(R:O$1) F29.P2
BMA6: F24.T2(T:O$1) F29.S2
BMA7: F25.D2(D:O$1) F29.T2
BMA8: F25.F2(F:O$1) F29.V2
BMA9: F25.J2(J:O$1) F30.D2
BMA10: F25.L2(L:O$1) F30.E2
BMA11: F25.N2(N:O$1) F30.H2
BT00: F25.U2(T:I$1) ; also sheet 4,7,9
DF0: E31.M2 F02.M2
DF1: E31.P2 F02.L2
DF2: E31.S2 F02.K2
GND [Supply]: A19.U2(T:G) A37.N2(U:C) B19.H2(F:G) B22.H2(F:G) D31.H2(F:G) D31.U2(T:G) ; also sheet 1,2,3,4,5,6,7,8,9,10,11,12,14
IF0: E31.T2 F02.J2
IF1: E31.V2 F02.H2
IF2: E32.T2 F02.F2
IOT: F31.V2 ; also sheet 9,10
LD(B): D29.N2(N:O$1) E31.K2
MPS: E32.S2
N$119: B19.E2(F:EN0) F36.F2(F:O$1)
READ: F31.E2 ; also sheet 14
SDF0: E30.D2 ; also sheet 8
SDF1: E30.E2 ; also sheet 8
SDF2: E30.H2 ; also sheet 8
SIF0: E30.K2 ; also sheet 8
SIF1: E30.M2 ; also sheet 8
SIF2: E30.P2 ; also sheet 8
T4: F36.D2(F:I$1) ; also sheet 4
WRITE: F31.D2 ; also sheet 14
WTB*A00(B): D31.T2(T:O) E31.E2
WTD(B): D29.R2(R:O$1) F31.S2
WTF(B): D29.T2(T:O$1) F31.T2
WTGB1: A19.S2(T:EN0)
WTX: F25.S2(R:I$1) ; also sheet 1,3,6,7,10,12
WTX(B): E31.D2 F25.R2(R:O$1)
WTX*(JMP+JMS): E29.R2(U:I$1) ; also sheet 5,6,11
WTX*(JMP+JMS)(B): E29.U2(U:O$1) E29.V2 E30.V2
Unconnected: B19.J2(F:I$1) B22.D2(F:PU0) B22.E2(F:EN0) D29.V2(T:I$2) D31.D2(F:PU0) D31.E2(F:EN0) D31.V2(T:I$1) E29.M2(N:I$3) E29.S2(U:I$2) E29.T2(U:I$3) F24.V2(T:I$2) F25.V2(T:I$2)

### Notes on the sheet
- OMD8S Connectors and Logic (in 8S)
- D-BS-OMD8S-0-4 (2)

## Power pins joined to a net without a drawn wire
-15V: A03.B2(-15V) A04.B2(-15V) A05.B2(-15V) A06.B2(-15V) A07.B2(-15V) A08.B2(-15V) A09.B2(-15V) A10.B2(-15V) A11.B2(-15V) A12.B2(-15V) A13.B2(-15V) A14.B2(-15V) A15.B2(-15V) A16.B2(-15V) A17.B2(-15V) A18.B2(-15V) A19.B2(-15V) A20.B2(-15V) A21.B2(-15V) A22.B2(-15V) A23.B2(-15V) A24.B2(-15V) A25.B2(-15V) A26.B2(-15V) A27.B2(-15V) A28.B2(-15V) A29.B2(-15V) A30.B2(-15V) A31.B2(-15V) A32.B2(-15V) A33.B2(-15V) A34.B2(-15V) A35.B2(-15V) A36.B2(-15V) A37.B2(-15V) A38.B2(-15V) A39.B2(-15V) A40.B2(-15V) B03.B2(-15V) B04.B2(-15V) B05.B2(-15V) B06.B2(-15V) B07.B2(-15V) B08.B2(-15V) B09.B2(-15V) B10.B2(-15V) B11.B2(-15V) B12.B2(-15V) B13.B2(-15V) B14.B2(-15V) B15.B2(-15V) B16.B2(-15V) B17.B2(-15V) B18.B2(-15V) B19.B2(-15V) B20.B2(-15V) B21.B2(-15V) B22.B2(-15V) B23.B2(-15V) B24.B2(-15V) B25.B2(-15V) B26.B2(-15V) B27.B2(-15V) B28.B2(-15V) B29.B2(-15V) B30.B2(-15V) B31.B2(-15V) B32.B2(-15V) B33.B2(-15V) B34.B2(-15V) B35.B2(-15V) B36.B2(-15V) B37.B2(-15V) B38.B2(-15V) B40.B2(-15V) C03.B2(-15V) C04.B2(-15V) C05.B2(-15V) C06.B2(-15V) C07.B2(-15V) C08.B2(-15V) C09.B2(-15V) C10.B2(-15V) C11.B2(-15V) C12.B2(-15V) C13.B2(-15V) C14.B2(-15V) C15.B2(-15V) C16.B2(-15V) C17.B2(-15V) C18.B2(-15V) C19.B2(-15V) C20.B2(-15V) C21.B2(-15V) C22.B2(B:-15V) C23.B2(-15V) C24.B2(-15V) C25.B2(B:-15V) C26.B2(-15V) C27.B2(B:-15V) C29.B2(-15V) C30.B2(-15V) C31.B2(-15V) C32.B2(-15V) C33.B2 C34.B2 C35.B2 C36.B2(-15V) C37.B2(-15V) C38.B2(-15V) C39.B2(-15V) C40.B2(-15V) D03.B2(-15V) D04.B2(-15V) D05.B2(-15V) D06.B2(-15V) D07.B2(-15V) D08.B2(-15V) D09.B2(-15V) D10.B2(-15V) D11.B2(-15V) D12.B2(-15V) D13.B2(-15V) D14.B2(-15V) D15.B2(-15V) D16.B2(-15V) D17.B2(-15V) D18.B2(-15V) D19.B2(-15V) D20.B2(-15V) D21.B2(-15V) D22.B2(-15V) D23.B2 D24.B2 D25.B2 D26.B2 D27.B2(-15V) D29.B2(-15V) D30.B2(-15V) D31.B2(-15V) D32.B2(-15V) D33.B2 D34.B2 D35.B2 D36.B2(-15V) D37.B2(-15V) D38.B2(-15V) D39.B2(-15V) E03.B2(-15V) E04.B2(-15V) E05.B2(-15V) E06.B2(-15V) E07.B2(-15V) E08.B2(-15V) E09.B2(-15V) E10.B2(-15V) E11.B2(-15V) E12.B2(-15V) E13.B2(-15V) E14.B2(-15V) E15.B2(-15V) E16.B2(-15V) E17.B2(-15V) E18.B2(-15V) E19.B2(-15V) E20.B2(-15V) E21.B2 E22.B2(-15V) E23.B2(-15V) E24.B2(-15V) E25.B2(-15V) E26.B2 E27.B2 E28.B2 E29.B2(-15V) E33.B2 E34.B2 E35.B2 E36.B2(-15V) F03.B2(-15V) F04.B2(-15V) F05.B2(-15V) F06.B2(-15V) F07.B2(-15V) F08.B2(-15V) F09.B2(-15V) F10.B2(-15V) F11.B2(-15V) F12.B2(-15V) F13.B2(-15V) F14.B2(-15V) F15.B2(-15V) F16.B2(-15V) F17.B2(-15V) F18.B2(-15V) F19.B2(-15V) F20.B2(-15V) F21.B2 F22.B2(-15V) F23.B2(-15V) F24.B2(-15V) F25.B2(-15V) F26.B2 F27.B2 F28.B2 F33.B2 F34.B2 F35.B2 F36.B2(-15V) F37.B2(-15V) F38.B2(-15V) F39.B2(-15V) F40.B2(-15V)
GND: A03.C2(GND) A04.C2(GND) A05.C2(GND) A06.C2(GND) A07.C2(GND) A08.C2(GND) A09.C2(GND) A10.C2(GND) A11.C2(GND) A12.C2(GND) A13.C2(GND) A14.C2(GND) A15.C2(GND) A17.C2(GND) A18.C2(GND) A19.C2(GND) A20.C2(GND) A21.C2(GND) A22.C2(GND) A23.C2(GND) A24.C2(GND) A25.C2(GND) A26.C2(GND) A27.C2(GND) A29.C2(GND) A30.C2(GND) A31.C2(GND) A32.C2(GND) A33.C2(GND) A34.C2(GND) A35.C2(GND) A36.C2(GND) A38.C2(GND) A39.C2(GND) A40.C2(GND) B03.C2(GND) B04.C2(GND) B05.C2(GND) B06.C2(GND) B07.C2(GND) B08.C2(GND) B09.C2(GND) B10.C2(GND) B11.C2(GND) B12.C2(GND) B13.C2(GND) B14.C2(GND) B15.C2(GND) B16.C2(GND) B17.C2(GND) B18.C2(GND) B19.C2(GND) B20.C2(GND) B21.C2(GND) B22.C2(GND) B23.C2(GND) B24.C2(GND) B25.C2(GND) B26.C2(GND) B28.C2(GND) B29.C2(GND) B30.C2(GND) B31.C2(GND) B32.C2(GND) B33.C2(GND) B34.C2(GND) B35.C2(GND) B36.C2(GND) B37.C2(GND) B38.C2(GND) B39.C2 B39.F2 B39.J2 B39.L2 B39.N2 B39.R2 B39.U2 B40.C2(GND) C03.C2(GND) C04.C2(GND) C05.C2(GND) C06.C2(GND) C07.C2(GND) C08.C2(GND) C09.C2(GND) C10.C2(GND) C11.C2(GND) C12.C2(GND) C13.C2(GND) C14.C2(GND) C15.C2(GND) C16.C2(GND) C17.C2(GND) C18.C2(GND) C19.C2(GND) C20.C2(GND) C21.C2(GND) C22.C2(C2:GND) C22.T2(T:GND) C22.U2(U:GND) C23.C2(GND) C24.C2(GND) C25.C2(C2:GND) C25.T2(T:GND) C25.U2(U:GND) C26.C2(GND) C27.C2(C2:GND) C27.T2(T:GND) C27.U2(U:GND) C29.C2(GND) C30.C2(GND) C31.C2(GND) C32.C2(GND) C33.C2 C34.C2 C35.C2 C36.C2(GND) C37.C2(GND) C39.C2(GND) C39.V2(V:GND) C40.C2(GND) D03.C2(GND) D04.C2(GND) D05.C2(GND) D06.C2(GND) D07.C2(GND) D08.C2(GND) D09.C2(GND) D10.C2(GND) D11.C2(GND) D12.C2(GND) D13.C2(GND) D14.C2(GND) D15.C2(GND) D16.C2(GND) D17.C2(GND) D18.C2(GND) D19.C2(GND) D20.C2(GND) D21.C2(GND) D22.C2(GND) D23.C2 D24.C2 D25.C2 D26.C2 D27.C2(GND) D29.C2(GND) D30.C2(GND) D31.C2(GND) D32.C2(GND) D33.C2 D34.C2 D35.C2 D36.C2(GND) D37.C2(GND) D38.C2(GND) D39.C2(GND) D40.C2 D40.F2 D40.J2 D40.L2 D40.N2 D40.R2 D40.U2 E03.C2(GND) E04.C2(GND) E05.C2(GND) E05.V2(V:GND) E06.C2(GND) E07.C2(GND) E08.C2(GND) E09.C2(GND) E10.C2(GND) E11.C2(GND) E12.C2(GND) E13.C2(GND) E14.C2(GND) E15.C2(GND) E16.C2(GND) E17.C2(GND) E18.C2(GND) E19.C2(GND) E20.C2(GND) E21.C2 E22.C2(GND) E23.C2(GND) E24.C2(GND) E25.C2(GND) E26.C2 E27.C2 E28.C2 E29.C2(GND) E30.C2 E30.F2 E30.J2 E30.L2 E30.N2 E30.R2 E30.U2 E31.C2 E31.F2 E31.J2 E31.L2 E31.N2 E31.R2 E31.U2 E32.C2 E32.F2 E32.J2 E32.L2 E32.N2 E32.R2 E32.U2 E33.C2 E34.C2 E35.C2 E36.C2(GND) E37.C2 E37.F2 E37.J2 E37.L2 E37.N2 E37.R2 E37.U2 E38.C2 E38.F2 E38.J2 E38.L2 E38.N2 E38.R2 E38.U2 E39.C2 E39.F2 E39.J2 E39.L2 E39.N2 E39.R2 E39.U2 E40.C2 E40.F2 E40.J2 E40.L2 E40.N2 E40.R2 E40.U2 F03.C2(GND) F04.C2(GND) F05.C2(GND) F06.C2(GND) F07.C2(GND) F08.C2(GND) F09.C2(GND) F10.C2(GND) F11.C2(GND) F12.C2(GND) F13.C2(GND) F14.C2(GND) F15.C2(GND) F16.C2(GND) F17.C2(GND) F18.C2(GND) F19.C2(GND) F20.C2(GND) F21.C2 F22.C2(GND) F23.C2(GND) F24.C2(GND) F25.C2(GND) F26.C2 F27.C2 F28.C2 F29.C2 F29.F2 F29.J2 F29.L2 F29.N2 F29.R2 F29.U2 F30.C2 F30.F2 F30.J2 F30.L2 F30.N2 F30.R2 F30.U2 F31.C2 F31.F2 F31.J2 F31.L2 F31.N2 F31.R2 F31.U2 F32.C2 F32.F2 F32.J2 F32.L2 F32.N2 F32.R2 F32.U2 F33.C2 F34.C2 F35.C2 F36.C2(GND) F40.C2(GND)
VCC: A03.A2(VCC) A04.A2(VCC) A05.A2(VCC) A06.A2(VCC) A07.A2(VCC) A08.A2(VCC) A09.A2(VCC) A10.A2(VCC) A11.A2(VCC) A12.A2(VCC) A13.A2(VCC) A14.A2(VCC) A15.A2(VCC) A16.A2(VCC) A17.A2(VCC) A18.A2(VCC) A19.A2(VCC) A20.A2(VCC) A21.A2(VCC) A22.A2(VCC) A23.A2(VCC) A24.A2(VCC) A25.A2(VCC) A26.A2(VCC) A27.A2(VCC) A28.A2(VCC) A29.A2(VCC) A30.A2(VCC) A31.A2(VCC) A32.A2(VCC) A33.A2(VCC) A34.A2(VCC) A35.A2(VCC) A36.A2(VCC) A37.A2(VCC) A38.A2(VCC) A39.A2(VCC) A40.A2(VCC) B03.A2(VCC) B04.A2(VCC) B05.A2(VCC) B06.A2(VCC) B07.A2(VCC) B08.A2(VCC) B09.A2(VCC) B10.A2(VCC) B11.A2(VCC) B12.A2(VCC) B13.A2(VCC) B14.A2(VCC) B15.A2(VCC) B16.A2(VCC) B17.A2(VCC) B18.A2(VCC) B19.A2(VCC) B20.A2(VCC) B21.A2(VCC) B22.A2(VCC) B23.A2(VCC) B24.A2(VCC) B25.A2(VCC) B26.A2(VCC) B27.A2(VCC) B28.A2(VCC) B29.A2(VCC) B30.A2(VCC) B31.A2(VCC) B32.A2(VCC) B33.A2(VCC) B34.A2(VCC) B35.A2(VCC) B36.A2(VCC) B37.A2(VCC) B38.A2(VCC) B40.A2(VCC) C03.A2(VCC) C04.A2(VCC) C05.A2(VCC) C06.A2(VCC) C07.A2(VCC) C08.A2(VCC) C09.A2(VCC) C10.A2(VCC) C11.A2(VCC) C12.A2(VCC) C13.A2(VCC) C14.A2(VCC) C15.A2(VCC) C16.A2(VCC) C17.A2(VCC) C18.A2(VCC) C19.A2(VCC) C20.A2(VCC) C21.A2(VCC) C22.A2(C2:VCC) C23.A2(VCC) C24.A2(VCC) C25.A2(C2:VCC) C26.A2(VCC) C27.A2(C2:VCC) C29.A2(VCC) C30.A2(VCC) C31.A2(VCC) C32.A2(VCC) C33.A2 C34.A2 C35.A2 C36.A2(VCC) C37.A2(VCC) C38.A2(VCC) C39.A2(VCC) C40.A2(VCC) D03.A2(VCC) D04.A2(VCC) D05.A2(VCC) D06.A2(VCC) D07.A2(VCC) D08.A2(VCC) D09.A2(VCC) D10.A2(VCC) D11.A2(VCC) D12.A2(VCC) D13.A2(VCC) D14.A2(VCC) D15.A2(VCC) D16.A2(VCC) D17.A2(VCC) D18.A2(VCC) D19.A2(VCC) D20.A2(VCC) D21.A2(VCC) D22.A2(VCC) D23.A2 D24.A2 D25.A2 D26.A2 D27.A2(VCC) D29.A2(VCC) D30.A2(VCC) D31.A2(VCC) D32.A2(VCC) D33.A2 D34.A2 D35.A2 D36.A2(VCC) D37.A2(VCC) D38.A2(VCC) D39.A2(VCC) E03.A2(VCC) E04.A2(VCC) E05.A2(VCC) E06.A2(VCC) E07.A2(VCC) E08.A2(VCC) E09.A2(VCC) E10.A2(VCC) E11.A2(VCC) E12.A2(VCC) E13.A2(VCC) E14.A2(VCC) E15.A2(VCC) E16.A2(VCC) E17.A2(VCC) E18.A2(VCC) E19.A2(VCC) E20.A2(VCC) E21.A2 E22.A2(VCC) E23.A2(VCC) E24.A2(VCC) E25.A2(VCC) E26.A2 E27.A2 E28.A2 E29.A2(VCC) E33.A2 E34.A2 E35.A2 E36.A2(VCC) F03.A2(VCC) F04.A2(VCC) F05.A2(VCC) F06.A2(VCC) F07.A2(VCC) F08.A2(VCC) F09.A2(VCC) F10.A2(VCC) F11.A2(VCC) F12.A2(VCC) F13.A2(VCC) F14.A2(VCC) F15.A2(VCC) F16.A2(VCC) F17.A2(VCC) F18.A2(VCC) F19.A2(VCC) F20.A2(VCC) F21.A2 F22.A2(VCC) F23.A2(VCC) F24.A2(VCC) F25.A2(VCC) F26.A2 F27.A2 F28.A2 F33.A2 F34.A2 F35.A2 F36.A2(VCC) F37.A2(VCC) F38.A2(VCC) F39.A2(VCC) F40.A2(VCC)

## Library data of the parts
A01 A02 B01 B02 C01 C02 C28 D01 D02 D28 E01 E02 F01 F02 = dec-m:W023: One-sided 18 pin connector/cable.
A03 A22 A33 A35 C11 E03 F06 F16 = dec-m:R001: 7 Diodes
A04 A29-A32 B04 B09 B10-B12 B28 B34 B35 C04 C15-C20 C29-C32 D04 D11-D16 D19 D20 D38 E04 E06 E12 E15-E20 E23-E25 F03-F05 F23 = dec-m:R202: Dual Flip-Flop
A05-A07 B03 B06 B07 C03 C06 D03 E07 = dec-m:W050: Indicator Driver
A08 A10 A15 A26 A27 B15 B17 B24 B25 B36 C14 D06-D08 D32 E09 E10 E11 E13 E14 E36 F14 F36 = dec-m:R113: Diode Gate
A09 A17 A18 A24 A40 B08 B16 B33 B37 C05 C09 C13 C21 C24 C36 D05 D18 D29 F10-F13 F18-F20 F24 F25 = dec-m:R107: 7 Inverters
A11 A14 A21 A23 A25 A34 A38 B13 B20 B23 C07 C10 C12 D36 E29 F07-F09 F15 F17 F40 = dec-m:R111: Diode Gate
A12 A13 A39 B14 B21 B26 C08 D39 = dec-m:R002: 5 Diode Networks
A16 A28 A37 B27 C38 F37-F39 = dec-m:R602: Dual Pulse Amplifier
A19 A20 B18 B19 B22 B29-B31 B38 C37 D09 D10 D31 = dec-m:R603: Triple Pulse Amplifier
A36 D37 = dec-m:R302: Dual Delay (One Shot)
B05 B40 E08 F22 = dec-m:W005: 15 Clamped Loads
B32 D30 E22 = dec-m:R401: Variable Frequency Clock
B39 D40 E37-E40 = dec-m:W028: One-sided 9 pin connector/cable with grounds (Negibus).
C22 C25 C27 = dec-m:M517: M517 Negative Bus Converter
C23 C26 = dec-m:W512: Positive Level Converter
C33-C35 D23-D26 D33-D35 E21 E26-E28 E33-E35 F21 F26-F28 F33-F35 = dec-m:EMPTY: Empty Slot
C39 E05 = dec-m:W501: Negative Input Converter and Schmidt Trigger
C40 = dec-m:W506: Power Monitor
D17 = dec-m:R151: Binary-to-Octal Decoder
D21 D22 D27 = dec-m:M507: M507 Negative Bus Converter
E30-E32 F29-F32 = dec-m:W021: One-sided 9 pin connector/cable with grounds (Negibus).

## Net classes
1 Supply: width 0.635 mm